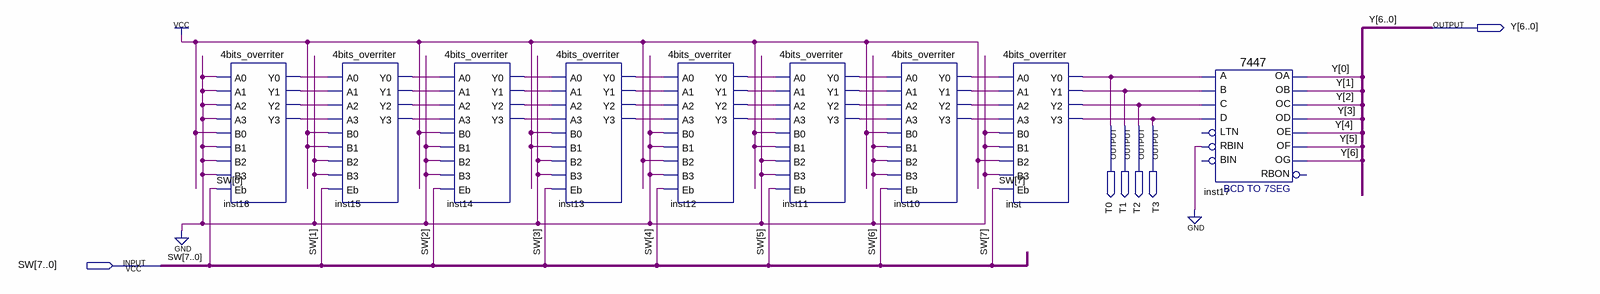
[diagram p0: schematic sheet]
// Quartus schematic main.bdf as structural Verilog: 9 symbols, 6 pins
module main (
  input  [7:0] SW,
  output [6:0] Y,
  output T0,
  output T1,
  output T2,
  output T3
);

  wire inst10_y0, inst10_y1, inst10_y2, inst10_y3, inst11_y0, inst11_y1, inst11_y2, inst11_y3, inst12_y0,
       inst12_y1, inst12_y2, inst12_y3, inst13_y0, inst13_y1, inst13_y2, inst13_y3, inst14_y0, inst14_y1,
       inst14_y2, inst14_y3, inst15_y0, inst15_y1, inst15_y2, inst15_y3, inst16_y0, inst16_y1, inst16_y2,
       inst16_y3;

  \4bits_overriter  inst16 (
    .A0(1'b0), .A1(1'b0), .A2(1'b0), .A3(1'b0), .B0(1'b1), .B1(1'b0), .B2(1'b0), .B3(1'b0), .Eb(SW[0]),
    .Y0(inst16_y0), .Y1(inst16_y1), .Y2(inst16_y2), .Y3(inst16_y3));
  \4bits_overriter  inst15 (
    .A0(inst16_y0), .A1(inst16_y1), .A2(inst16_y2), .A3(inst16_y3), .B0(1'b1), .B1(1'b1), .B2(1'b0),
    .B3(1'b0), .Eb(SW[1]), .Y0(inst15_y0), .Y1(inst15_y1), .Y2(inst15_y2), .Y3(inst15_y3));
  \4bits_overriter  inst14 (
    .A0(inst15_y0), .A1(inst15_y1), .A2(inst15_y2), .A3(inst15_y3), .B0(1'b1), .B1(1'b0), .B2(1'b0),
    .B3(1'b0), .Eb(SW[2]), .Y0(inst14_y0), .Y1(inst14_y1), .Y2(inst14_y2), .Y3(inst14_y3));
  \4bits_overriter  inst13 (
    .A0(inst14_y0), .A1(inst14_y1), .A2(inst14_y2), .A3(inst14_y3), .B0(1'b1), .B1(1'b1), .B2(1'b0),
    .B3(1'b0), .Eb(SW[3]), .Y0(inst13_y0), .Y1(inst13_y1), .Y2(inst13_y2), .Y3(inst13_y3));
  \4bits_overriter  inst12 (
    .A0(inst13_y0), .A1(inst13_y1), .A2(inst13_y2), .A3(inst13_y3), .B0(1'b0), .B1(1'b0), .B2(1'b1),
    .B3(1'b0), .Eb(SW[4]), .Y0(inst12_y0), .Y1(inst12_y1), .Y2(inst12_y2), .Y3(inst12_y3));
  \4bits_overriter  inst11 (
    .A0(inst12_y0), .A1(inst12_y1), .A2(inst12_y2), .A3(inst12_y3), .B0(1'b1), .B1(1'b1), .B2(1'b0),
    .B3(1'b0), .Eb(SW[5]), .Y0(inst11_y0), .Y1(inst11_y1), .Y2(inst11_y2), .Y3(inst11_y3));
  \4bits_overriter  inst10 (
    .A0(inst11_y0), .A1(inst11_y1), .A2(inst11_y2), .A3(inst11_y3), .B0(1'b1), .B1(1'b0), .B2(1'b0),
    .B3(1'b0), .Eb(SW[6]), .Y0(inst10_y0), .Y1(inst10_y1), .Y2(inst10_y2), .Y3(inst10_y3));
  \4bits_overriter  inst (
    .A0(inst10_y0), .A1(inst10_y1), .A2(inst10_y2), .A3(inst10_y3), .B0(1'b0), .B1(1'b0), .B2(1'b1),
    .B3(1'b0), .Eb(SW[7]), .Y0(T0), .Y1(T1), .Y2(T2), .Y3(T3));
  \7447  inst17 (
    .B(T1), .C(T2), .D(T3), .RBIN(1'b0), .A(T0), .OB(Y[1]), .OC(Y[2]), .OE(Y[4]), .OD(Y[3]), .OF(Y[5]),
    .OG(Y[6]), .OA(Y[0]));  // open: LTN, BIN, RBON
endmodule
